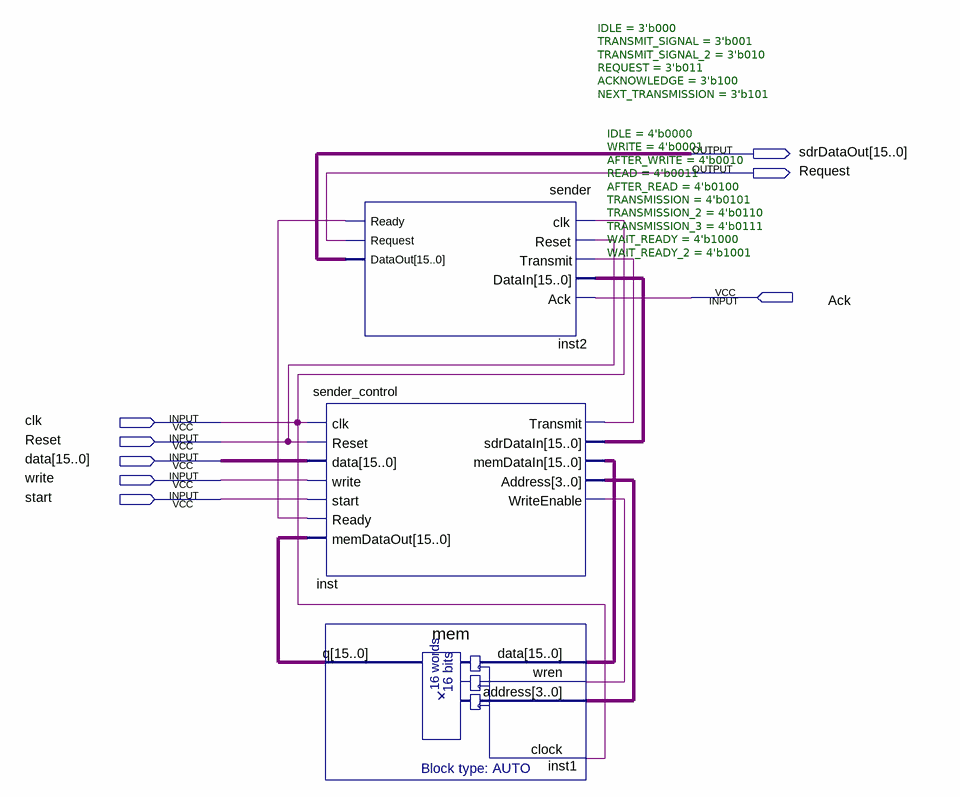
[diagram p0: schematic sheet]
// Quartus schematic sender_ic.bdf as structural Verilog: 3 symbols, 8 pins
module sender_ic (
  input  Ack,
  input  clk,
  input  Reset,
  input  [15:0] data,
  input  write,
  input  start,
  output [15:0] sdrDataOut,
  output Request
);

  wire inst2_ready, inst_transmit, inst_writeenable;
  wire [3:0] inst_address;
  wire [15:0] inst1_q, inst_memdatain, inst_sdrdatain;

  sender #(.IDLE(3'b000), .TRANSMIT_SIGNAL(3'b001), .TRANSMIT_SIGNAL_2(3'b010), .REQUEST(3'b011), .ACKNOWLEDGE(3'b100), .NEXT_TRANSMISSION(3'b101)) inst2 (
    .clk(clk), .Reset(Reset), .Transmit(inst_transmit), .DataIn(inst_sdrdatain), .Ack(Ack),
    .Ready(inst2_ready), .Request(Request), .DataOut(sdrDataOut));
  sender_control #(.IDLE(4'b0000), .WRITE(4'b0001), .AFTER_WRITE(4'b0010), .READ(4'b0011), .AFTER_READ(4'b0100), .TRANSMISSION(4'b0101), .TRANSMISSION_2(4'b0110), .TRANSMISSION_3(4'b0111), .WAIT_READY(4'b1000), .WAIT_READY_2(4'b1001)) inst (
    .clk(clk), .Reset(Reset), .data(data), .write(write), .start(start), .Ready(inst2_ready),
    .memDataOut(inst1_q), .Transmit(inst_transmit), .sdrDataIn(inst_sdrdatain), .memDataIn(inst_memdatain),
    .Address(inst_address), .WriteEnable(inst_writeenable));
  mem inst1 (.data(inst_memdatain), .wren(inst_writeenable), .address(inst_address), .clock(clk), .q(inst1_q));
endmodule
